# EAGLE design PB-to-PTS (EAGLE 6.6.0)
AUTH: ZSS; BRD_MON: October 2015; BRD_NAME: PB-PTS-Interface; REV: v2.0.0
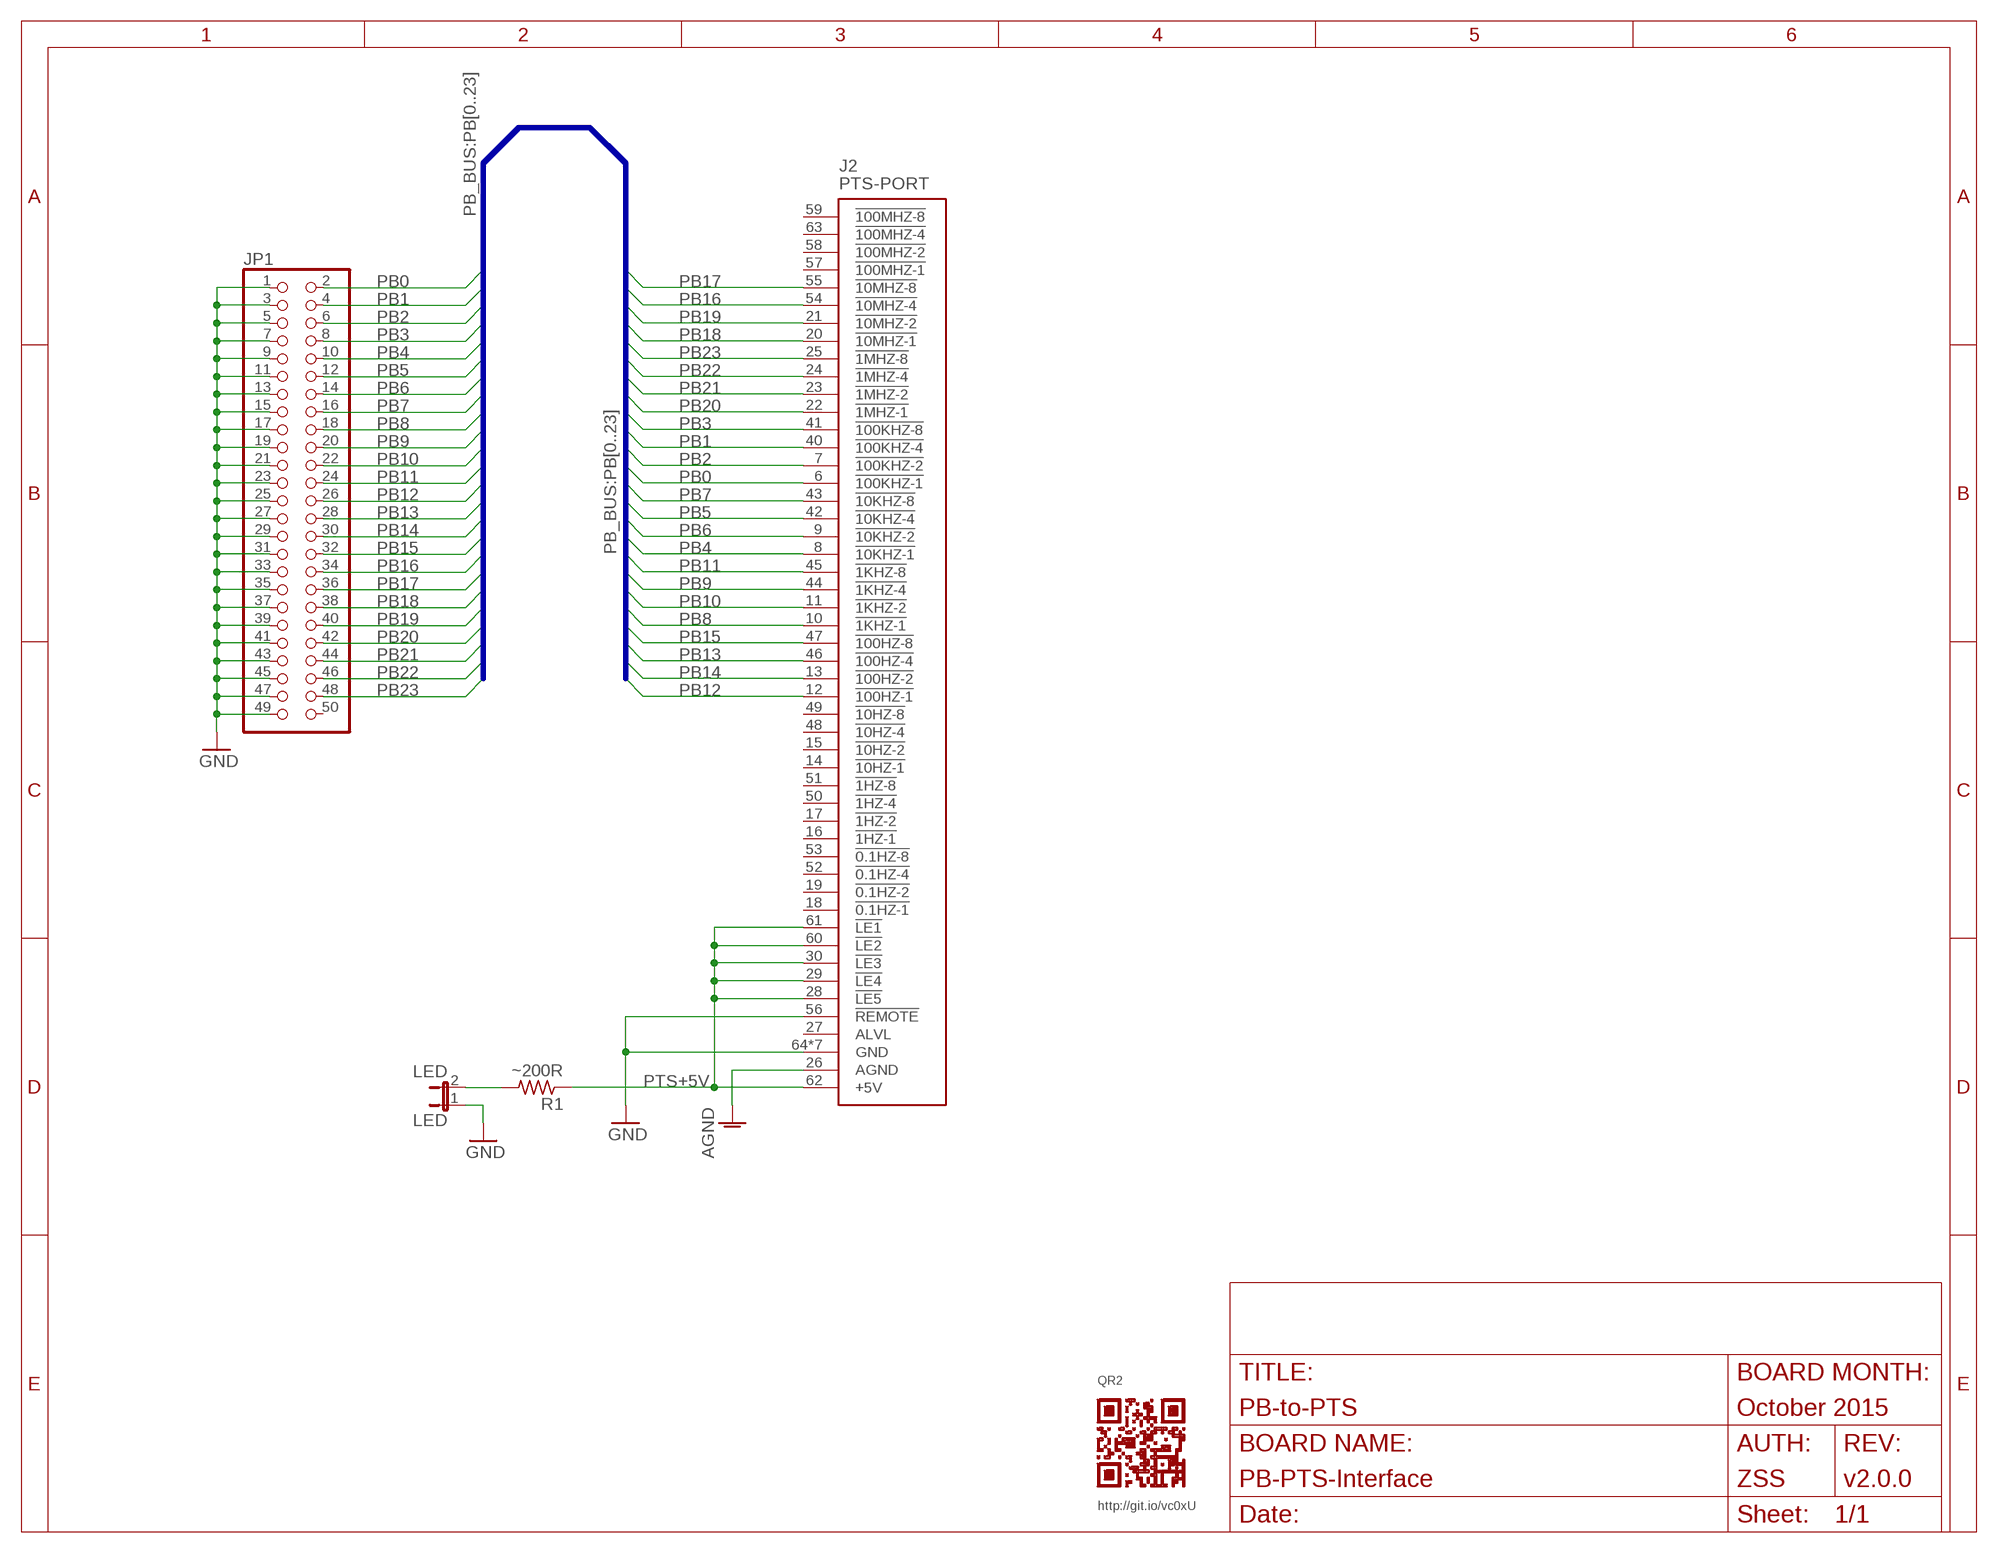
[diagram p0: schematic, sheet 1]

## Parts
J2  PTS-PORT  [MOLEX-73776-0201]
JP1  PINHD-2X25  [2X25]
LED  LED  JP1E  [JP1]
QR2  QR-HTTP://GIT.IO/VC0XU  [QR-HTTP://GIT.IO/VC0XU]
R1  ~200R  R-US_R0805  [R0805]

## Nets
AGND: J2.26(AGND)
GND: J2.56(!REMOTE) J2.64(GND) J2.SHIELD1(GND) J2.SHIELD2(GND) J2.SHIELD3(GND) J2.SHIELD4(GND) J2.SHIELD5(GND) J2.SHIELD6(GND) JP1.1 JP1.3 JP1.5 JP1.7 JP1.9 JP1.11 JP1.13 JP1.15 JP1.17 JP1.19 JP1.21 JP1.23 JP1.25 JP1.27 JP1.29 JP1.31 JP1.33 JP1.35 JP1.37 JP1.39 JP1.41 JP1.43 JP1.45 JP1.47 JP1.49 LED.1
N$3: LED.2 R1.2
PB0: J2.6(!100KHZ-1) JP1.2
PB1: J2.40(!100KHZ-4) JP1.4
PB2: J2.7(!100KHZ-2) JP1.6
PB3: J2.41(!100KHZ-8) JP1.8
PB4: J2.8(!10KHZ-1) JP1.10
PB5: J2.42(!10KHZ-4) JP1.12
PB6: J2.9(!10KHZ-2) JP1.14
PB7: J2.43(!10KHZ-8) JP1.16
PB8: J2.10(!1KHZ-1) JP1.18
PB9: J2.44(!1KHZ-4) JP1.20
PB10: J2.11(!1KHZ-2) JP1.22
PB11: J2.45(!1KHZ-8) JP1.24
PB12: J2.12(!100HZ-1) JP1.26
PB13: J2.46(!100HZ-4) JP1.28
PB14: J2.13(!100HZ-2) JP1.30
PB15: J2.47(!100HZ-8) JP1.32
PB16: J2.54(!10MHZ-4) JP1.34
PB17: J2.55(!10MHZ-8) JP1.36
PB18: J2.20(!10MHZ-1) JP1.38
PB19: J2.21(!10MHZ-2) JP1.40
PB20: J2.22(!1MHZ-1) JP1.42
PB21: J2.23(!1MHZ-2) JP1.44
PB22: J2.24(!1MHZ-4) JP1.46
PB23: J2.25(!1MHZ-8) JP1.48
PTS+5V: J2.28(!LE5) J2.29(!LE4) J2.30(!LE3) J2.60(!LE2) J2.61(!LE1) J2.62(+5V) R1.1
Unconnected: J2.14(!10HZ-1) J2.15(!10HZ-2) J2.16(!1HZ-1) J2.17(!1HZ-2) J2.18(!0.1HZ-1) J2.19(!0.1HZ-2) J2.27(ALVL) J2.48(!10HZ-4) J2.49(!10HZ-8) J2.50(!1HZ-4) J2.51(!1HZ-8) J2.52(!0.1HZ-4) J2.53(!0.1HZ-8) J2.57(!100MHZ-1) J2.58(!100MHZ-2) J2.59(!100MHZ-8) J2.63(!100MHZ-4) JP1.50

## Buses
PB_BUS:PB[0..23]

## Library data of the parts
J2 = PTS_Board_Lib:PTS-PORT: PTS Connector for controlling Freq. & Amplitude; Connected through VHDCI plug, will need adapter to CN50.
JP1 = pinhead:PINHD-2X25: PIN HEADER
LED = jumper:JP1E: JUMPER
QR2 = QR-git.io-vc0xU:QR-HTTP://GIT.IO/VC0XU: QR Code pointing to http://git.io/vc0xU; QR_DEST: http://git.io/vc0xU
R1 = resistor:R-US_: RESISTOR, American symbol

## Net classes
0 default: width 0.152 mm, clearance 0.152 mm

## Board
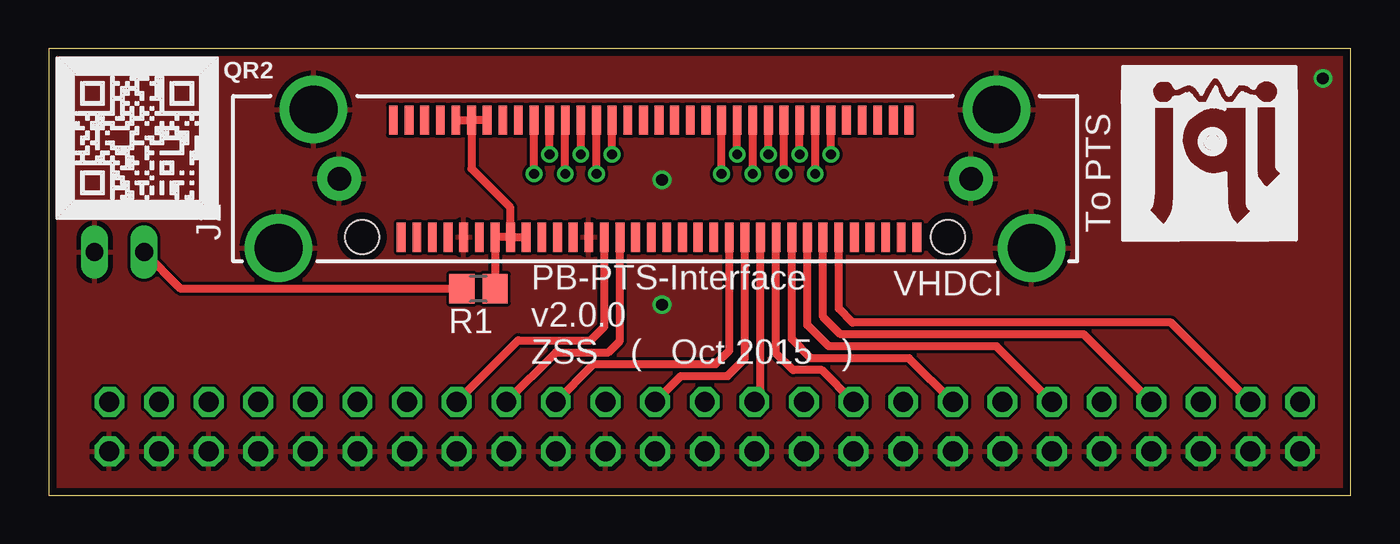
[diagram p1: board, top side]
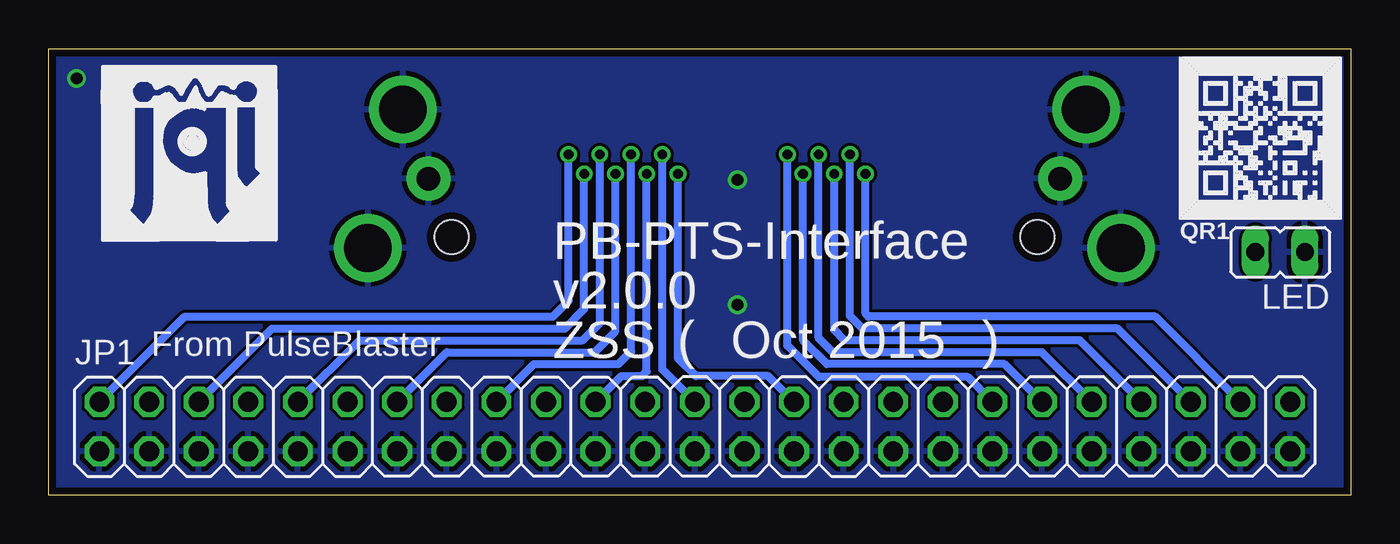
[diagram p2: board, bottom side, seen from below]

Size 66.65 x 22.86 mm. Coordinates in mm from the lower left corner, seen from the top.
Outline: 0,0 66.65,0 66.65,22.86 0,22.86 0,0
Copper layers (1*16): Top 0.0356mm / dielectric 1.5011mm / Bottom 0.0356mm
Design rules "oshpark": minimum track width 6mil, minimum drill 13mil, track to track 6mil, track to pad 6mil, pad to pad 6mil, via to via 6mil, smd to smd 6mil, copper to edge 15mil, drill to drill 6mil, minimum pad ring 7mil, minimum via ring 7mil, stop-mask expansion 3mil, vias tented up to drill 0mil, thermal gap 10mil

### Footprints (pad centres in the part's own frame; a part is rotated, then mirrored left to right if it is on the bottom)
MOLEX-73776-0201 = smd 0.45 x 1.5: 1 13,3; 2 12.2,3; 3 11.4,3; 4 10.6,3; 5 9.8,3; 6 9,3; 7 8.2,3; 8 7.4,3; 9 6.6,3; 10 5.8,3; 11 5,3; 12 4.2,3; 13 3.4,3; 14 2.6,3; 15 1.8,3; 16 1,3; 17 0.2,3; 18 -0.6,3; 19 -1.4,3; 20 -2.2,3; 21 -3,3; 22 -3.8,3; 23 -4.6,3; 24 -5.4,3; 25 -6.2,3; 26 -7,3; 27 -7.8,3; 28 -8.6,3; 29 -9.4,3; 30 -10.2,3; 31 -11,3; 32 -11.8,3; 33 -12.6,3; 34 -13.4,3; 35 13.4,-3; 36 12.6,-3; 37 11.8,-3; 38 11,-3; 39 10.2,-3; 40 9.4,-3; 41 8.6,-3; 42 7.8,-3; 43 7,-3; 44 6.2,-3; 45 5.4,-3; 46 4.6,-3; 47 3.8,-3; 48 3,-3; 49 2.2,-3; 50 1.4,-3; 51 0.6,-3; 52 -0.2,-3; 53 -1,-3; 54 -1.8,-3; 55 -2.6,-3; 56 -3.4,-3; 57 -4.2,-3; 58 -5,-3; 59 -5.8,-3; 60 -6.6,-3; 61 -7.4,-3; 62 -8.2,-3; 63 -9,-3; 64 -9.8,-3; 65 -10.6,-3; 66 -11.4,-3; 67 -12.2,-3; 68 -13,-3 | drill 1.2 pad 2.25: SHIELD1 -16.175,0; SHIELD2 16.175,0 | drill 2.44 pad 3.24: SHIELD3 -19.275,-3.55; SHIELD4 19.275,-3.55; SHIELD5 -17.485,3.55; SHIELD6 17.485,3.55 | hole 1.75: -14.995,-2.98; 14.995,-2.98
2X25 = drill 1.016 octagon: 1 -30.48,-1.27; 2 -30.48,1.27; 3 -27.94,-1.27; 4 -27.94,1.27; 5 -25.4,-1.27; 6 -25.4,1.27; 7 -22.86,-1.27; 8 -22.86,1.27; 9 -20.32,-1.27; 10 -20.32,1.27; 11 -17.78,-1.27; 12 -17.78,1.27; 13 -15.24,-1.27; 14 -15.24,1.27; 15 -12.7,-1.27; 16 -12.7,1.27; 17 -10.16,-1.27; 18 -10.16,1.27; 19 -7.62,-1.27; 20 -7.62,1.27; 21 -5.08,-1.27; 22 -5.08,1.27; 23 -2.54,-1.27; 24 -2.54,1.27; 25 0,-1.27; 26 0,1.27; 27 2.54,-1.27; 28 2.54,1.27; 29 5.08,-1.27; 30 5.08,1.27; 31 7.62,-1.27; 32 7.62,1.27; 33 10.16,-1.27; 34 10.16,1.27; 35 12.7,-1.27; 36 12.7,1.27; 37 15.24,-1.27; 38 15.24,1.27; 39 17.78,-1.27; 40 17.78,1.27; 41 20.32,-1.27; 42 20.32,1.27; 43 22.86,-1.27; 44 22.86,1.27; 45 25.4,-1.27; 46 25.4,1.27; 47 27.94,-1.27; 48 27.94,1.27; 49 30.48,-1.27; 50 30.48,1.27
JP1 = drill 0.914 long: 1 0,-1.27; 2 0,1.27
R0805 = smd 1.3 x 1.5: 1 -0.85,0; 2 0.85,0

### Placement (x,y rotation side)
J2  31.04,16.21 0 top
JP1  33.58,3.51 0 bottom
LED  3.61,12.45 90 bottom
QR1  QR-HTTP://GIT.IO/VC0XU  [QR-HTTP://GIT.IO/VC0XU]  4.62,18.29 0 bottom
QR2  4.52,18.29 0 top
R1  22,10.57 180 top
U$3  [JQI_LOGO_NEGATIVE-SILKSCREEN]  54.97,13.06 0 top
U$4  [JQI_LOGO_NEGATIVE-SILKSCREEN]  63.91,13.06 0 bottom
U$5  [INFO_BLOCK-0.05]  24.69,6.71 0 top
U$6  [INFO_BLOCK-0.076]  40.84,7.01 0 bottom

### Tracks (layer width: path | path; a pad name or v marks a point on that pad's centre or on a via)
GND  (via drill 0.6)
  other vias: 31.39,16.15 31.39,9.75 65.23,21.34
  pour Top: 66.65,22.86 0,22.86 0,0 66.65,0
  pour Bottom: 66.65,22.86 0,22.86 0,0 66.65,0
N$3
  Top 0.406: R1.2 6.76,10.57 LED.2
PB0  (via drill 0.5)
  Top 0.406: v40.04,17.45 J2.6
  Bottom 0.406: JP1.2 59.69,9.14 40.84,9.14 40.04,9.95 v40.04,17.45
PB1
  Top 0.406: JP1.4 57.45,8.84 41.15,8.84 40.44,9.55 J2.40
PB2  (via drill 0.5)
  Top 0.406: v39.24,16.45 J2.7
  Bottom 0.406: JP1.6 55.22,8.53 40.23,8.53 39.24,9.53 v39.24,16.45
PB3
  Top 0.406: JP1.8 52.98,8.23 40.54,8.23 39.64,9.13 J2.41
PB4  (via drill 0.5)
  Top 0.406: v38.44,17.45 J2.8
  Bottom 0.406: JP1.10 50.75,7.92 39.32,7.92 38.44,8.8 v38.44,17.45
PB5
  Top 0.406: JP1.12 48.51,7.62 39.93,7.62 38.84,8.71 J2.42
PB6  (via drill 0.5)
  Top 0.406: v37.64,16.45 J2.9
  Bottom 0.406: JP1.14 46.28,7.32 38.71,7.32 37.64,8.39 v37.64,16.45
PB7
  Top 0.406: JP1.16 44.04,7.01 39.01,7.01 38.04,7.99 J2.43
PB8  (via drill 0.5)
  Top 0.406: v36.84,17.45 J2.10
  Bottom 0.406: JP1.18 41.81,6.71 37.49,6.71 36.84,7.36 v36.84,17.45
PB9
  Top 0.406: JP1.20 39.57,6.4 38.1,6.4 37.24,7.26 J2.44
PB10  (via drill 0.5)
  Top 0.406: v36.04,16.45 J2.11
  Bottom 0.406: JP1.22 37.34,6.1 36.27,6.1 36.04,6.33 v36.04,16.45
PB11
  Top 0.406: JP1.24 36.44,5.09 J2.45
PB12  (via drill 0.5)
  Top 0.406: v35.24,17.45 J2.12
  Bottom 0.406: JP1.26 35.24,6.43 v35.24,17.45
PB13
  Top 0.406: JP1.28 32.36,6.1 34.75,6.1 35.64,6.99 J2.46
PB14  (via drill 0.5)
  Top 0.406: v34.44,16.45 J2.13
  Bottom 0.406: JP1.30 29.82,6.1 33.53,6.1 34.44,7.01 v34.44,16.45
PB15
  Top 0.406: JP1.32 27.89,6.71 34.14,6.71 34.84,7.41 J2.47
PB16
  Top 0.406: JP1.34 25.96,7.32 28.65,7.32 29.24,7.9 J2.54
PB17
  Top 0.406: JP1.36 24.03,7.92 27.74,7.92 28.44,8.63 J2.55
PB18  (via drill 0.5)
  Top 0.406: v28.84,17.45 J2.20
  Bottom 0.406: JP1.38 19.61,6.04 27.23,6.04 28.84,7.66 v28.84,17.45
PB19  (via drill 0.5)
  Top 0.406: v28.04,16.45 J2.21
  Bottom 0.406: JP1.40 17.73,6.71 26.82,6.71 28.04,7.92 v28.04,16.45
PB20  (via drill 0.5)
  Top 0.406: v27.24,17.45 J2.22
  Bottom 0.406: JP1.42 15.8,7.32 26.52,7.32 27.24,8.04 v27.24,17.45
PB21  (via drill 0.5)
  Top 0.406: v26.44,16.45 J2.23
  Bottom 0.406: JP1.44 13.87,7.92 25.91,7.92 26.44,8.46 v26.44,16.45
PB22  (via drill 0.5)
  Top 0.406: v25.64,17.45 J2.24
  Bottom 0.406: JP1.46 11.94,8.53 24.99,8.53 25.64,9.18 v25.64,17.45
PB23  (via drill 0.5)
  Top 0.406: v24.84,16.45 J2.25
  Bottom 0.406: JP1.48 10.01,9.14 24.69,9.14 24.84,9.29 v24.84,16.45
PTS+5V
  Top 0.406: J2.61 J2.60 | J2.61 J2.62 22.85,13.2 R1.1 | J2.61 23.64,14.71 21.64,16.71 J2.29 | J2.28 J2.29 | J2.30 J2.29

### Text on the board
tNames: To PTS | VHDCI
bNames: From PulseBlaster
bDocu: +5V